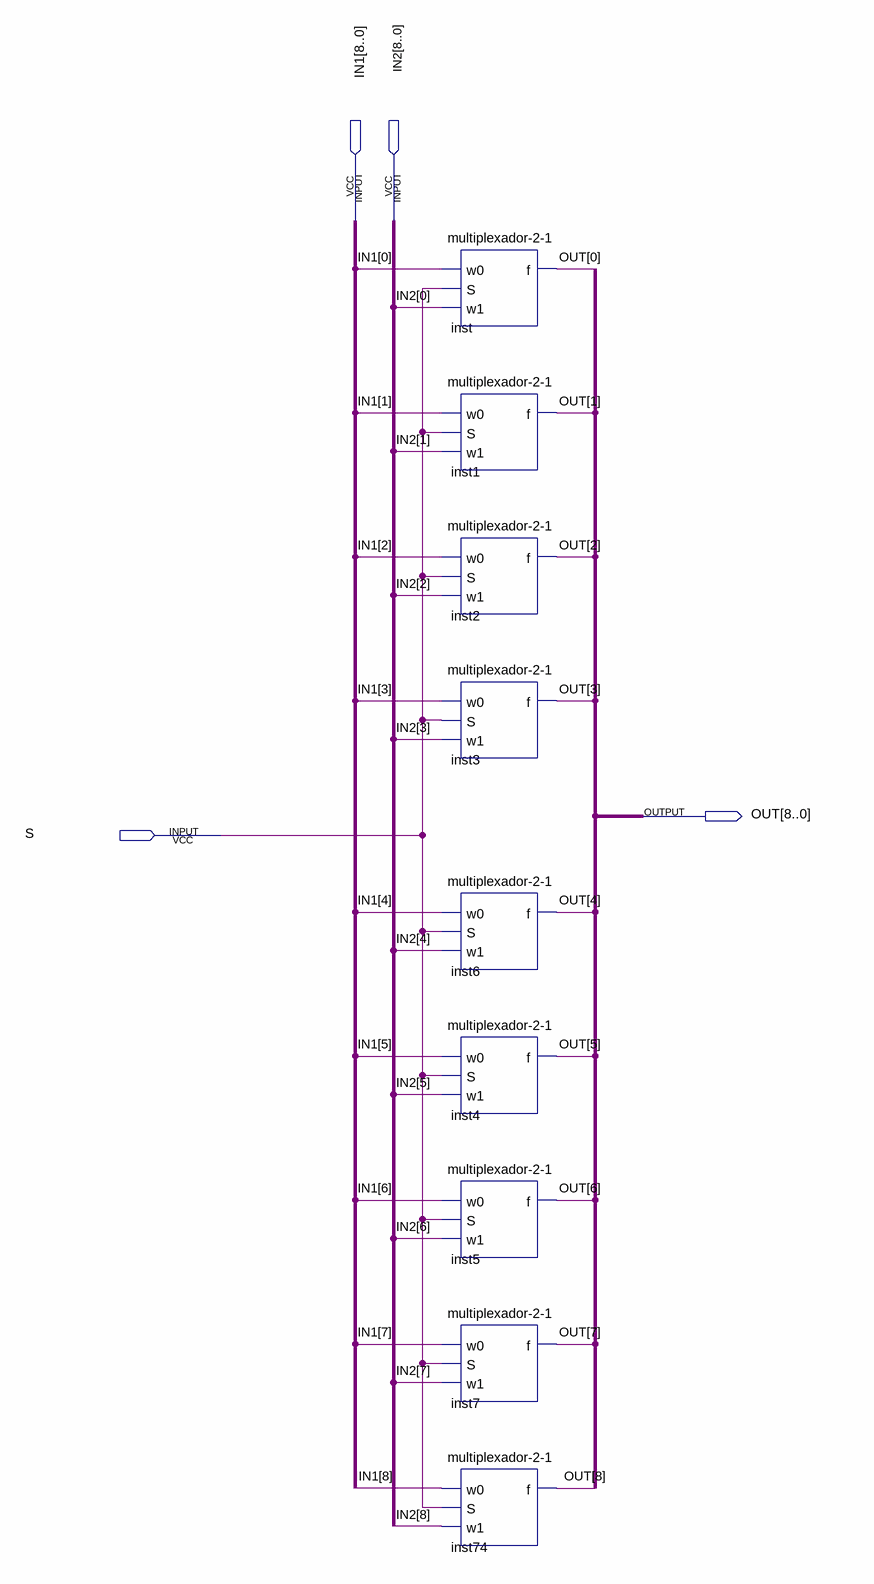
[diagram p0: schematic sheet]
// Quartus schematic multiplexador_18x9.bdf as structural Verilog: 9 symbols, 4 pins
module multiplexador_18x9 (
  input  [8:0] IN1,
  input  [8:0] IN2,
  input  S,
  output [8:0] OUT
);

  \multiplexador-2-1  inst (.w0(IN1[0]), .S(S), .w1(IN2[0]), .f(OUT[0]));
  \multiplexador-2-1  inst1 (.w0(IN1[1]), .S(S), .w1(IN2[1]), .f(OUT[1]));
  \multiplexador-2-1  inst2 (.w0(IN1[2]), .S(S), .w1(IN2[2]), .f(OUT[2]));
  \multiplexador-2-1  inst3 (.w0(IN1[3]), .S(S), .w1(IN2[3]), .f(OUT[3]));
  \multiplexador-2-1  inst6 (.w0(IN1[4]), .S(S), .w1(IN2[4]), .f(OUT[4]));
  \multiplexador-2-1  inst4 (.w0(IN1[5]), .S(S), .w1(IN2[5]), .f(OUT[5]));
  \multiplexador-2-1  inst5 (.w0(IN1[6]), .S(S), .w1(IN2[6]), .f(OUT[6]));
  \multiplexador-2-1  inst7 (.w0(IN1[7]), .S(S), .w1(IN2[7]), .f(OUT[7]));
  \multiplexador-2-1  inst74 (.w0(IN1[8]), .S(S), .w1(IN2[8]), .f(OUT[8]));
endmodule
